# EAGLE design indoorac22 (EAGLE 8.6.3)
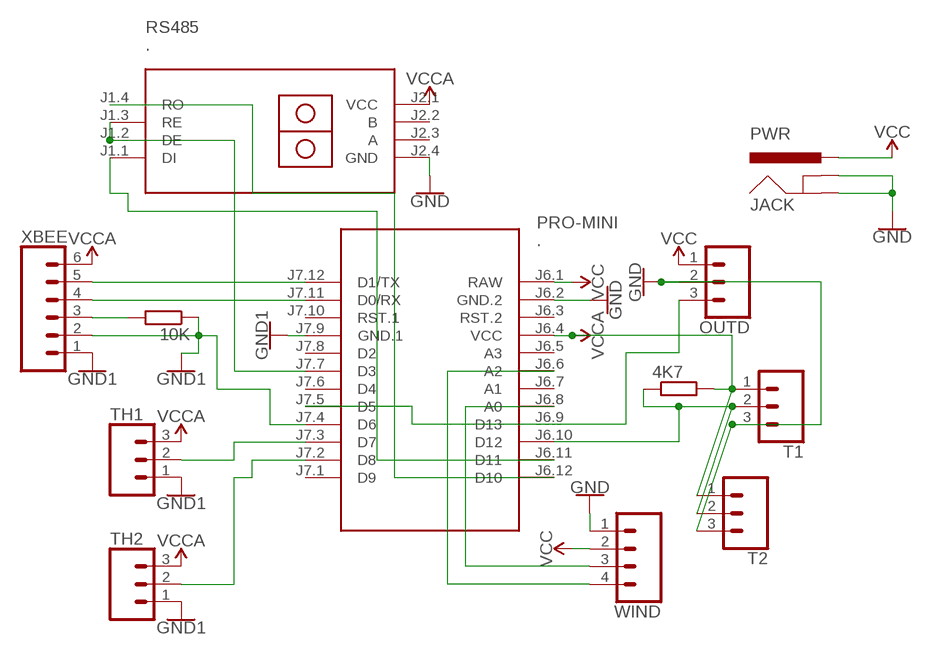
[diagram p0: schematic, sheet 1]

## Parts
4K7  R0204/7  [0204/7]
10K  R0204/7  [0204/7]
JACK  PWR  POWER_JACKPTH_LOCK  [POWER_JACK_PTH_LOCK]
OUTD  CONN_03-SCREW-5MM  [SCREWTERMINAL-5MM-3]
PRO-MINI  .  ARDUINO-PRO-MINI-5.0V#SMP  [ARDUINO-PRO-MINI#SMP]
RS485  .  RS485-TTL-CONVERTER  [RS485-TTL-CONVERTER]
T1  CONN_03  [1X03]
T2  CONN_03  [1X03]
TH1  CONN_03  [1X03]
TH2  CONN_03  [1X03]
WIND  CONN_04  [1X04]
XBEE  CONN_06SILK_FEMALE_PTH  [1X06]

## Nets
GND: 10K.1 PRO-MINI.J7.4(D6) PRO-MINI.J7.9(GND.1) TH1.1 TH2.1 XBEE.1 XBEE.2 ; supply symbol labelled GND1
GND1: JACK.GND JACK.GNDBREAK OUTD.2 PRO-MINI.J6.2(GND.2) RS485.J2.4(GND) T1.3 T2.3 WIND.1 ; supply symbol labelled GND
N$1: 4K7.1 PRO-MINI.J6.10(D12) T1.2 T2.2
N$2: PRO-MINI.J6.8(A0) WIND.3
N$3: 10K.2 XBEE.3
N$4: PRO-MINI.J6.6(A2) WIND.4
N$5: PRO-MINI.J7.7(D3) RS485.J1.2(DE) RS485.J1.3(RE)
N$6: OUTD.3 PRO-MINI.J7.5(D5)
N$7: PRO-MINI.J6.11(D11) RS485.J1.1(DI)
N$8: PRO-MINI.J6.12(D10) RS485.J1.4(RO)
N$9: PRO-MINI.J7.12(D1/TX) XBEE.5
N$10: PRO-MINI.J7.11(D0/RX) XBEE.4
N$12: PRO-MINI.J7.3(D7) TH1.2
N$13: PRO-MINI.J7.2(D8) TH2.2
VCC: JACK.PWR OUTD.1 PRO-MINI.J6.1(RAW) WIND.2
VCCA: 4K7.2 PRO-MINI.J6.4(VCC) RS485.J2.1(VCC) T1.1 T2.1 TH1.3 TH2.3 XBEE.6
Unconnected: PRO-MINI.J6.3(RST.2) PRO-MINI.J6.5(A3) PRO-MINI.J6.7(A1) PRO-MINI.J6.9(D13) PRO-MINI.J7.1(D9) PRO-MINI.J7.6(D4) PRO-MINI.J7.8(D2) PRO-MINI.J7.10(RST.1) RS485.J2.2(B) RS485.J2.3(A)

## Library data of the parts
4K7 10K = eagle-ltspice:R: RESISTOR, European symbol; SPICEMODEL: NONE; SPICEPREFIX: R
JACK = SparkFun-Connectors:POWER_JACK: Power Jack Connector This is the standard 5.5mm barrel jack for power. The PTH is the most common, proven, reliable, footprint. The Slot footprint only works if the mill layer is transmitted to the PCB fab house so be warned. Here are the connectors we sell at SparkFun: DC Barrel Power Jack/Connector <https://www.sparkfun.com/products/119> (PRT-00119) DC Barrel Power Jack/Connector (SMD) <https://www.sparkfun.com/products/12748> (PRT-12748) DC Barrel Jack Adapter - Breadboard Compatible <https://www.sparkfun.com/products/10811> (PRT-10811) It is used on this SparkFun product (and many, many others): SparkFun RedBoard - Programmed with Arduino <https://www.sparkfun.com/products/12757> (DEV-12757) Also, if you need a mating power supply or connector, please check these out: Wall Adapter Power Supply - 9VDC 650mA <https://www.sparkfun.com/products/298> (TOL-00298) DC Barrel Jack Adapter - Male <https://www.sparkfun.com/products/10287> (PRT-10287); PROD_ID: CONN-08197; SF_ID: PRT-00119
OUTD = SparkFun-Connectors:CONN_03: Multi connection point. Often used as Generic Header-pin footprint for 0.1 inch spaced/style header connections On any of the 0.1 inch spaced packages, you can populate with these: Break Away Headers - Straight <https://www.sparkfun.com/products/116> (PRT-00116) Break Away Male Headers - Right Angle <https://www.sparkfun.com/products/553> (PRT-00553) Female Headers <https://www.sparkfun.com/products/115> (PRT-00115) Break Away Headers - Machine Pin <https://www.sparkfun.com/products/117> (PRT-00117) Break Away Female Headers - Swiss Machine Pin <https://www.sparkfun.com/products/743> (PRT-00743) Stackable Header - 3 Pin (Female, 0.1") <https://www.sparkfun.com/products/13875> (PRT-13875) For SCREWTERMINALS and SPRING TERMINALS visit here: Screw Terimnals on SparkFun.com <https://www.sparkfun.com/search/results?term=Screw+Terminals> (5mm/3.5mm/2.54mm spacing) This device is also useful as a general connection point to wire up your design to another part of your project. Our various solder wires solder well into these plated through hole pads. Hook-Up Wire - Assortment (Stranded, 22 AWG) <https://www.sparkfun.com/products/11375> (PRT-11375) Hook-Up Wire - Assortment (Solid Core, 22 AWG) <https://www.sparkfun.com/products/11367> (PRT-11367) View the entire wire category on our website here <https://www.sparkfun.com/categories/141> Special notes: Molex polarized connector foot print use with SKU : PRT-08232 with associated crimp pins and housings.; PROD_ID: CONN-10134; SF_SKU: PRT-08433
PRO-MINI = diy-modules:ARDUINO-PRO-MINI-*#SMP: Arduino Pro Mini (and compatible devices) with 2 connectors only More details available here: https://www.arduino.cc/en/Main/ArduinoBoardProMini Click here to find device on ebay.com <http://www.ebay.com/sch/arduino+pro+mini>
RS485 = diy-modules:RS485-TTL-CONVERTER: RS485 to TTL converter based on MAX485 chip
T1 T2 TH1 TH2 = SparkFun-Connectors:CONN_03: Multi connection point. Often used as Generic Header-pin footprint for 0.1 inch spaced/style header connections On any of the 0.1 inch spaced packages, you can populate with these: Break Away Headers - Straight <https://www.sparkfun.com/products/116> (PRT-00116) Break Away Male Headers - Right Angle <https://www.sparkfun.com/products/553> (PRT-00553) Female Headers <https://www.sparkfun.com/products/115> (PRT-00115) Break Away Headers - Machine Pin <https://www.sparkfun.com/products/117> (PRT-00117) Break Away Female Headers - Swiss Machine Pin <https://www.sparkfun.com/products/743> (PRT-00743) Stackable Header - 3 Pin (Female, 0.1") <https://www.sparkfun.com/products/13875> (PRT-13875) For SCREWTERMINALS and SPRING TERMINALS visit here: Screw Terimnals on SparkFun.com <https://www.sparkfun.com/search/results?term=Screw+Terminals> (5mm/3.5mm/2.54mm spacing) This device is also useful as a general connection point to wire up your design to another part of your project. Our various solder wires solder well into these plated through hole pads. Hook-Up Wire - Assortment (Stranded, 22 AWG) <https://www.sparkfun.com/products/11375> (PRT-11375) Hook-Up Wire - Assortment (Solid Core, 22 AWG) <https://www.sparkfun.com/products/11367> (PRT-11367) View the entire wire category on our website here <https://www.sparkfun.com/categories/141> Special notes: Molex polarized connector foot print use with SKU : PRT-08232 with associated crimp pins and housings.
WIND = SparkFun-Connectors:CONN_04: Multi connection point. Often used as Generic Header-pin footprint for 0.1 inch spaced/style header connections On any of the 0.1 inch spaced packages, you can populate with these: Break Away Headers - Straight <https://www.sparkfun.com/products/116> (PRT-00116) Break Away Male Headers - Right Angle <https://www.sparkfun.com/products/553> (PRT-00553) Female Headers <https://www.sparkfun.com/products/115> (PRT-00115) Break Away Headers - Machine Pin <https://www.sparkfun.com/products/117> (PRT-00117) Break Away Female Headers - Swiss Machine Pin <https://www.sparkfun.com/products/743> (PRT-00743) For SCREWTERMINALS and SPRING TERMINALS visit here: Screw Terimnals on SparkFun.com <https://www.sparkfun.com/search/results?term=Screw+Terminals> (5mm/3.5mm/2.54mm spacing) This device is also useful as a general connection point to wire up your design to another part of your project. Our various solder wires solder well into these plated through hole pads. Hook-Up Wire - Assortment (Stranded, 22 AWG) <https://www.sparkfun.com/products/11375> (PRT-11375) Hook-Up Wire - Assortment (Solid Core, 22 AWG) <https://www.sparkfun.com/products/11367> (PRT-11367) View the entire wire category on our website here <https://www.sparkfun.com/categories/141> Special notes: Molex polarized connector foot print use with SKU : PRT-08231 with associated crimp pins and housings. 1MM SMD Version SKU: PRT-10208; PROD_ID: CONN-09696
XBEE = SparkFun-Connectors:CONN_06: Multi connection point. Often used as Generic Header-pin footprint for 0.1 inch spaced/style header connections On any of the 0.1 inch spaced packages, you can populate with these: Break Away Headers - Straight <https://www.sparkfun.com/products/116> (PRT-00116) Break Away Male Headers - Right Angle <https://www.sparkfun.com/products/553> (PRT-00553) Female Headers <https://www.sparkfun.com/products/115> (PRT-00115) Break Away Headers - Machine Pin <https://www.sparkfun.com/products/117> (PRT-00117) Break Away Female Headers - Swiss Machine Pin <https://www.sparkfun.com/products/743> (PRT-00743) Arduino Stackable Header - 6 Pin <https://www.sparkfun.com/products/9280> (PRT-09280) For SCREWTERMINALS and SPRING TERMINALS visit here: Screw Terimnals on SparkFun.com <https://www.sparkfun.com/search/results?term=Screw+Terminals> (5mm/3.5mm/2.54mm spacing) This device is also useful as a general connection point to wire up your design to another part of your project. Our various solder wires solder well into these plated through hole pads. Hook-Up Wire - Assortment (Stranded, 22 AWG) <https://www.sparkfun.com/products/11375> (PRT-11375) Hook-Up Wire - Assortment (Solid Core, 22 AWG) <https://www.sparkfun.com/products/11367> (PRT-11367) View the entire wire category on our website here <https://www.sparkfun.com/categories/141>; PROD_ID: CONN-08437

## Board
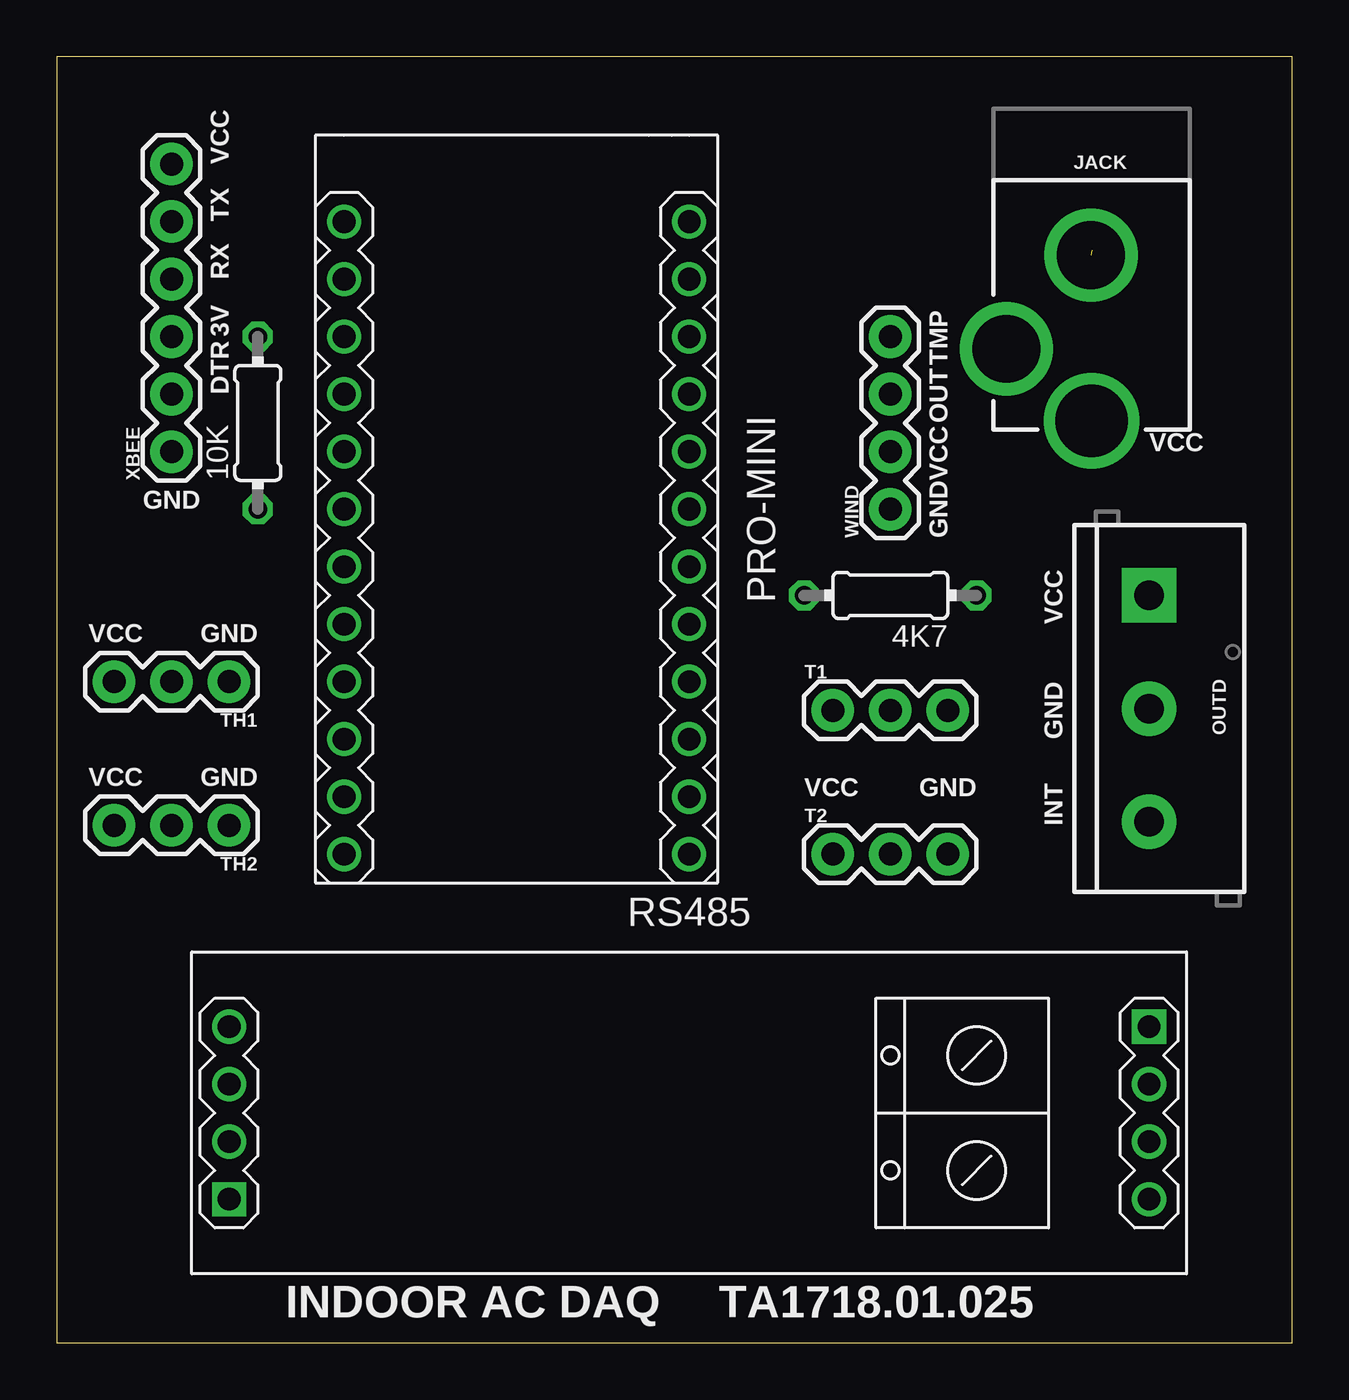
[diagram p1: board, top side]
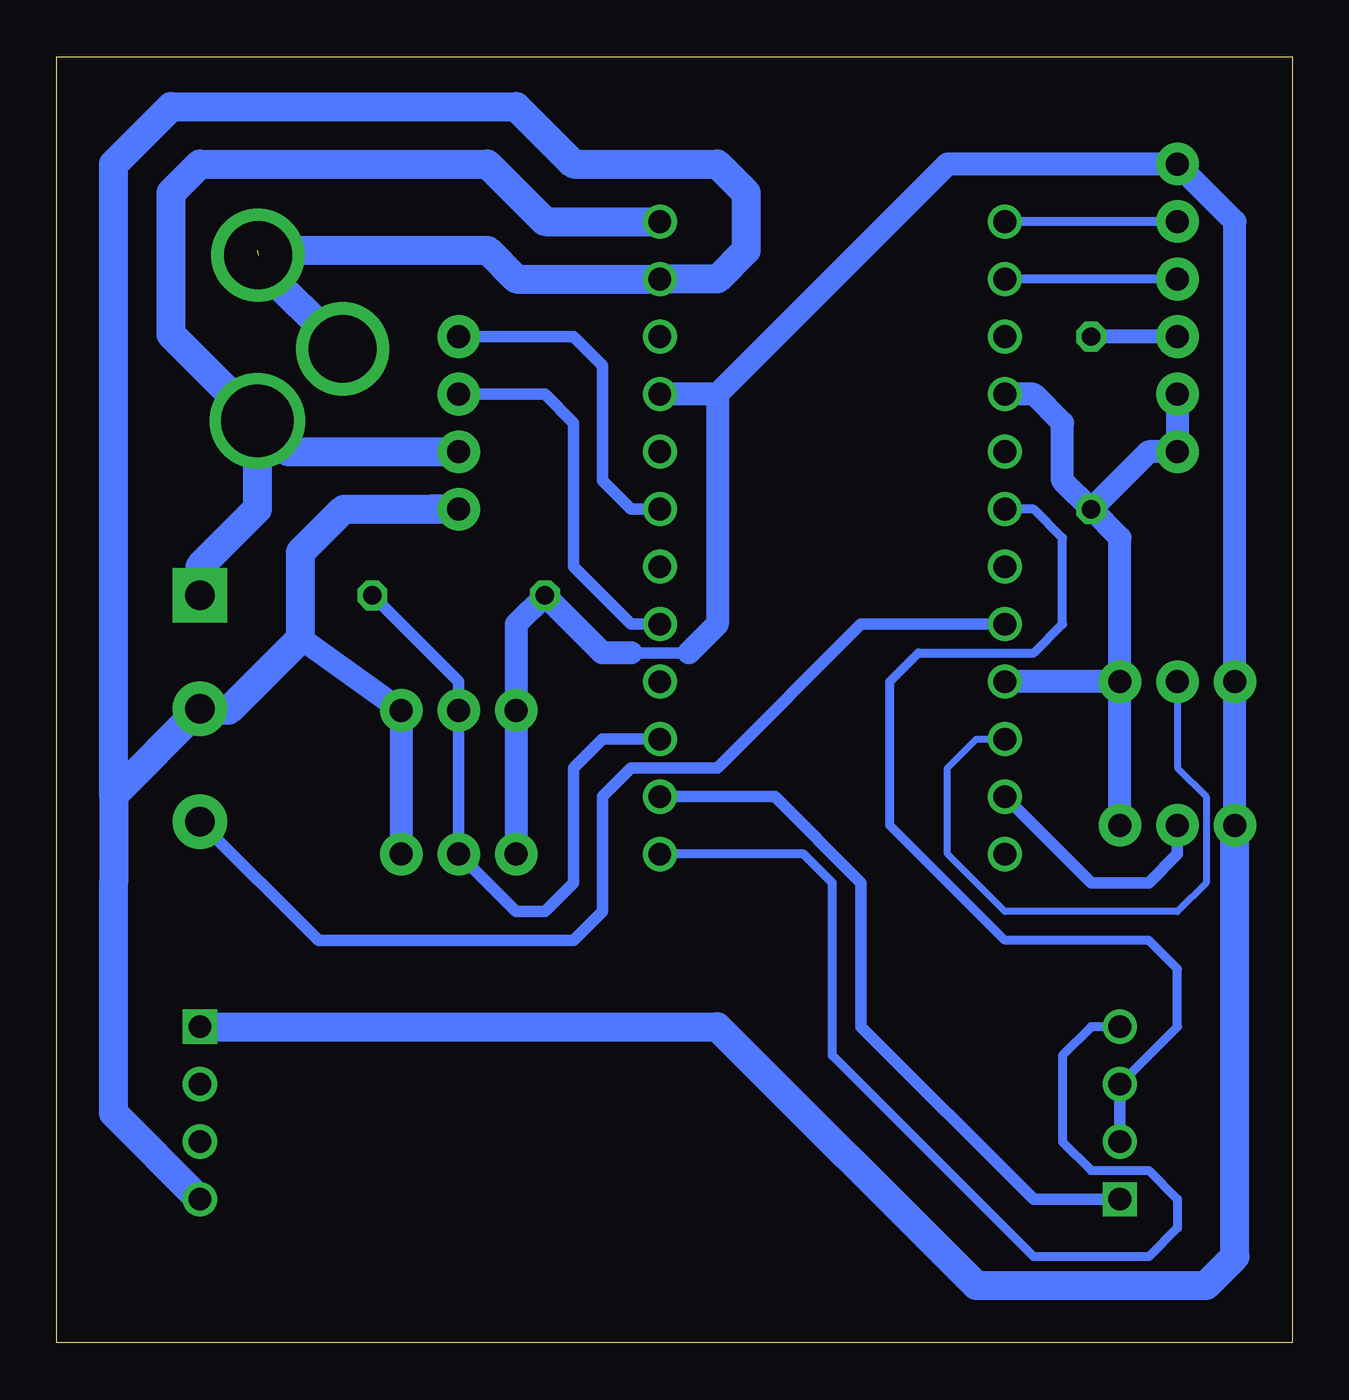
[diagram p2: board, bottom side, seen from below]

Size 54.59 x 56.82 mm. Coordinates in mm from the lower left corner, seen from the top.
Outline: 0,0 54.59,0 54.59,56.82 0,56.82 0,0
Copper layers (1*16): Top 0.035mm / dielectric 1.5mm / Bottom 0.035mm
Design rules "default": minimum track width 6mil, minimum drill 0.35mm, track to track 6mil, track to pad 6mil, pad to pad 6mil, via to via 6mil, smd to smd 6mil, copper to edge 40mil, drill to drill 6mil, minimum pad ring 10mil, minimum via ring 8mil, stop-mask expansion 4mil, vias tented up to drill 0mil, thermal gap 10mil

### Footprints (pad centres in the part's own frame; a part is rotated, then mirrored left to right if it is on the bottom)
0204/7 = drill 0.813 octagon: 1 -3.81,0; 2 3.81,0
POWER_JACK_PTH_LOCK = drill 2.997 pad 4.115: GND 0.025,6.557; GNDBREAK 3.762,10.7 | drill 3.2 pad 4.115: PWR 0,13.878
SCREWTERMINAL-5MM-3 = drill 1.3 pad 2.413 square: 1 0,0 | drill 1.3 pad 2.413: 2 5,0; 3 10,0
ARDUINO-PRO-MINI#SMP = drill 1: J6.1 -12.7,7.62; J6.2 -10.16,7.62; J6.3 -7.62,7.62; J6.4 -5.08,7.62; J6.5 -2.54,7.62; J6.6 0,7.62; J6.7 2.54,7.62; J6.8 5.08,7.62; J6.9 7.62,7.62; J6.10 10.16,7.62; J6.11 12.7,7.62; J6.12 15.24,7.62; J7.1 15.24,-7.62; J7.2 12.7,-7.62; J7.3 10.16,-7.62; J7.4 7.62,-7.62; J7.5 5.08,-7.62; J7.6 2.54,-7.62; J7.7 0,-7.62; J7.8 -2.54,-7.62; J7.9 -5.08,-7.62; J7.10 -7.62,-7.62; J7.11 -10.16,-7.62; J7.12 -12.7,-7.62
RS485-TTL-CONVERTER = drill 1 square: J1.1 -20.32,-3.81; J2.1 20.32,3.81 | drill 1: J1.2 -20.32,-1.27; J1.3 -20.32,1.27; J1.4 -20.32,3.81; J2.2 20.32,1.27; J2.3 20.32,-1.27; J2.4 20.32,-3.81
1X03 = drill 1.016 pad 1.88: 1 0,0; 2 2.54,0; 3 5.08,0
1X04 = drill 1.016 pad 1.88: 1 0,0; 2 2.54,0; 3 5.08,0; 4 7.62,0
1X06 = drill 1.016 pad 1.88: 1 0,0; 2 2.54,0; 3 5.08,0; 4 7.62,0; 5 10.16,0; 6 12.7,0

### Placement (x,y rotation side)
4K7  36.83,33.02 180 top
10K  8.89,40.64 90 top
JACK  45.72,54.61 180 top
OUTD  48.26,33.02 270 top
PRO-MINI  20.32,36.83 270 top
RS485  27.94,10.16 0 top
T1  34.29,27.94 0 top
T2  34.29,21.59 0 top
TH1  7.62,29.21 180 top
TH2  7.62,22.86 180 top
WIND  36.83,36.83 90 top
XBEE  5.08,39.37 90 top

### Tracks (layer width: path | path; a pad name or v marks a point on that pad's centre or on a via)
GND
  Bottom 1.016: XBEE.2 XBEE.1 6.35,39.37 10K.1 | TH2.1 TH1.1 | TH1.1 7.62,35.56 10K.1 | 10K.1 10.16,38.1 10.16,40.64 11.43,41.91 PRO-MINI.J7.9 | TH1.1 PRO-MINI.J7.4
GND1  (1 unrouted)
  Bottom 0.508: OUTD.2 48.18,27.94
  Bottom 1.016: T2.3 T1.3 43.82,31.12
  Bottom 1.27: 38.1,36.83 WIND.1 41.91,36.83 43.82,34.93 43.82,31.12 46.99,27.94 48.18,27.94 | JACK.GNDBREAK 45.72,47.67 45.72,48.26 35.56,48.26 34.29,46.99 PRO-MINI.J6.2 25.4,46.99 24.13,48.26 24.13,50.8 25.4,52.07 31.75,52.07 34.29,54.61 49.53,54.61 52.07,52.07 52.07,24.21 | RS485.J2.4 52.07,10.16 52.07,20.32 52.07,24.21 | OUTD.2 52.07,24.21
N$1
  Bottom 0.508: PRO-MINI.J6.10 30.48,26.67 31.75,25.4 31.75,20.32 33.02,19.05 34.29,19.05 T2.2 T1.2 36.83,29.21 4K7.1
N$2
  Bottom 0.508: WIND.3 33.02,41.91 31.75,40.64 31.75,34.29 29.21,31.75 PRO-MINI.J6.8
N$3
  Bottom 0.61: XBEE.3 10K.2
N$4
  Bottom 0.508: WIND.4 31.75,44.45 30.48,43.18 30.48,38.1 29.21,36.83 PRO-MINI.J6.6
N$5
  Bottom 0.406: RS485.J1.3 5.08,13.97 5.08,16.51 6.35,17.78 12.7,17.78 17.78,22.86 17.78,29.21 16.51,30.48 11.43,30.48 10.16,31.75 10.16,35.56 11.43,36.83 PRO-MINI.J7.7
  Bottom 0.508: RS485.J1.2 RS485.J1.3
N$6
  Bottom 0.508: OUTD.3 43.02,17.78 31.75,17.78 30.48,19.05 30.48,24.13 29.21,25.4 25.4,25.4 19.05,31.75 PRO-MINI.J7.5
N$7
  Bottom 0.508: RS485.J1.1 11.43,6.35 19.05,13.97 19.05,20.32 22.86,24.13 PRO-MINI.J6.11
N$8
  Bottom 0.406: RS485.J1.4 8.89,13.97 10.16,12.7 10.16,8.89 8.89,7.62 6.35,7.62 5.08,6.35 5.08,5.08 6.35,3.81 11.43,3.81 20.32,12.7 20.32,20.32 21.59,21.59 PRO-MINI.J6.12
N$9
  Bottom 0.406: XBEE.5 PRO-MINI.J7.12
N$10
  Bottom 0.406: XBEE.4 PRO-MINI.J7.11
N$12
  Bottom 0.305: TH1.2 5.08,25.4 3.81,24.13 3.81,20.32 5.08,19.05 12.7,19.05 15.24,21.59 15.24,25.4 13.97,26.67 PRO-MINI.J7.3
N$13
  Bottom 0.508: TH2.2 5.08,21.59 6.35,20.32 8.89,20.32 PRO-MINI.J7.2
VCC
  Bottom 1.27: JACK.PWR 49.53,44.54 49.53,50.8 48.26,52.07 35.56,52.07 33.02,49.53 PRO-MINI.J6.1 | JACK.PWR 45.72,36.83 48.26,34.29 OUTD.1 | JACK.PWR 44.36,39.37 WIND.2
VCCA
  Bottom 0.508: 26.67,30.48 29.21,30.48
  Bottom 1.016: 25.4,41.91 PRO-MINI.J6.4 | 25.4,41.91 15.24,52.07 XBEE.6 2.54,49.53 TH1.3 TH2.3 | T2.1 T1.1 34.29,31.75 4K7.2 30.48,30.48 29.21,30.48 | 25.4,41.91 25.4,31.75 26.67,30.48
  Bottom 1.27: RS485.J2.1 25.4,13.97 13.97,2.54 3.81,2.54 2.54,3.81 TH2.3

### Text on the board
tNames: VCC | TX | RX | 3V | TMP | DTR | OUT | VCC | VCC | GND | GND | VCC | GND | VCC | GND | VCC | GND | VCC | GND | INT | INDOOR AC DAQ | TA1718.01.025